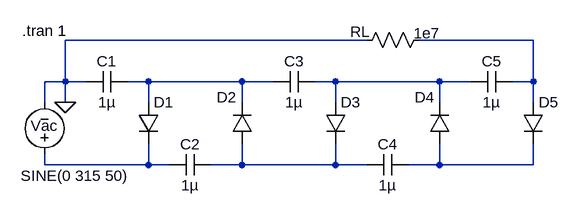
[diagram p0: schematic Quintuplicador.asc]
Quintuplicador.asc, the LTspice schematic file:
Version 4
SHEET 1 896 680
WIRE 496 32 32 32
WIRE 752 32 576 32
WIRE 32 96 32 32
WIRE 32 96 0 96
WIRE 64 96 32 96
WIRE 160 96 128 96
WIRE 304 96 160 96
WIRE 352 96 304 96
WIRE 448 96 416 96
WIRE 608 96 448 96
WIRE 656 96 608 96
WIRE 752 96 752 32
WIRE 752 96 720 96
WIRE 0 128 0 96
WIRE 32 128 32 96
WIRE 160 128 160 96
WIRE 304 128 304 96
WIRE 448 128 448 96
WIRE 608 128 608 96
WIRE 752 128 752 96
WIRE 0 224 0 208
WIRE 160 224 160 192
WIRE 160 224 0 224
WIRE 192 224 160 224
WIRE 304 224 304 192
WIRE 304 224 256 224
WIRE 448 224 448 192
WIRE 448 224 304 224
WIRE 496 224 448 224
WIRE 608 224 608 192
WIRE 608 224 560 224
WIRE 752 224 752 192
WIRE 752 224 608 224
FLAG 32 128 0
SYMBOL cap 128 80 R90
WINDOW 0 0 32 VBottom 0
WINDOW 3 32 32 VTop 0
SYMATTR InstName C1
SYMATTR Value 1µ
SYMBOL diode 144 128 R0
WINDOW 3 24 72 Invisible 0
SYMATTR InstName D1
SYMATTR Value MR760
SYMBOL cap 256 208 R90
WINDOW 0 0 32 VBottom 0
WINDOW 3 32 32 VTop 0
SYMATTR InstName C2
SYMATTR Value 1µ
SYMBOL diode 320 192 R180
WINDOW 0 24 72 Left 0
WINDOW 3 24 0 Invisible 0
SYMATTR InstName D2
SYMATTR Value MR760
SYMBOL cap 416 80 R90
WINDOW 0 0 32 VBottom 0
WINDOW 3 32 32 VTop 0
SYMATTR InstName C3
SYMATTR Value 1µ
SYMBOL diode 432 128 R0
WINDOW 3 24 72 Invisible 0
SYMATTR InstName D3
SYMATTR Value MR760
SYMBOL voltage 0 224 R180
WINDOW 0 -20 60 Left 0
WINDOW 3 -130 -17 Left 0
WINDOW 123 0 0 Left 0
SYMATTR InstName Vac
SYMATTR Value SINE(0 315 50)
SYMATTR SpiceLine Rser=1m
SYMBOL cap 560 208 R90
WINDOW 0 0 32 VBottom 0
WINDOW 3 32 32 VTop 0
SYMATTR InstName C4
SYMATTR Value 1µ
SYMBOL diode 624 192 R180
WINDOW 0 24 72 Left 0
WINDOW 3 24 0 Invisible 0
SYMATTR InstName D4
SYMATTR Value MR760
SYMBOL cap 720 80 R90
WINDOW 0 0 32 VBottom 0
WINDOW 3 32 32 VTop 0
SYMATTR InstName C5
SYMATTR Value 1µ
SYMBOL diode 736 128 R0
WINDOW 3 24 72 Invisible 0
SYMATTR InstName D5
SYMATTR Value MR760
SYMBOL res 592 16 R90
WINDOW 0 19 106 VBottom 0
WINDOW 3 -10 4 VTop 0
SYMATTR InstName RL
SYMATTR Value 1e7
TEXT -34 18 Left 0 !.tran 1

The netlist it stands for:
* Quintuplicador.asc
C1 N002 0 1µ
D1 N002 N004 MR760
C2 N005 N004 1µ
D2 N005 N002 MR760
C3 N003 N002 1µ
D3 N003 N005 MR760
Vac N004 0 SINE(0 315 50) Rser=1m
C4 N006 N005 1µ
D4 N006 N003 MR760
C5 N001 N003 1µ
D5 N001 N006 MR760
RL N001 0 1e7
.model D D
.lib standard.dio
.tran 1
.backanno
.end